# EAGLE design controller2 (EAGLE 7.4.0)
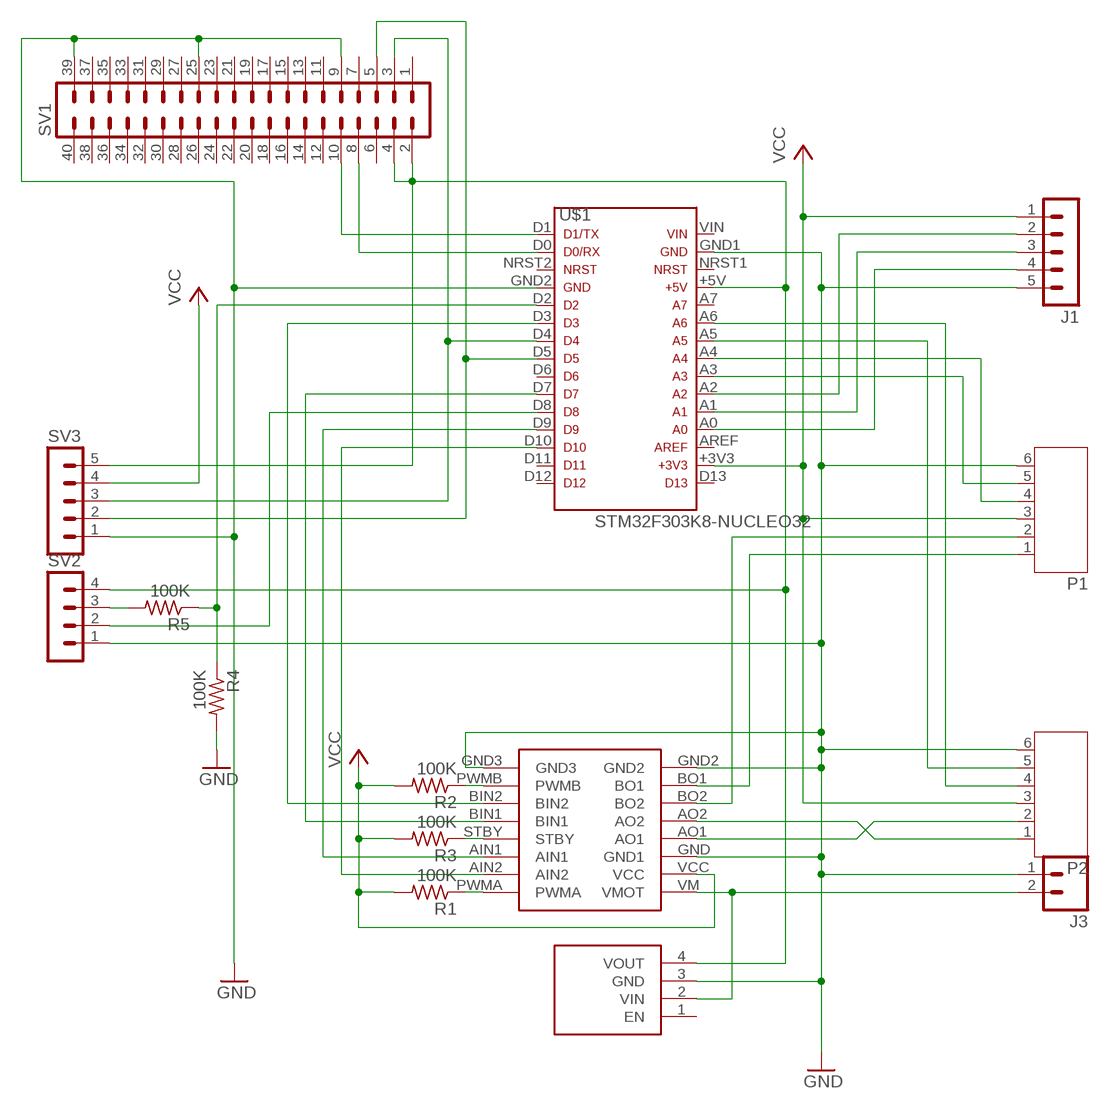
[diagram p0: schematic, sheet 1]

## Parts
J1  MA05-1  [MA05-1]
J3  M02JST-PTH-VERT  [JST-2-PTH-VERT]
P1  JST-PH6  [JST-PH6]
P2  JST-PH6  [JST-PH6]
R1  100K  R-US_M0805  [M0805]
R2  100K  R-US_M0805  [M0805]
R3  100K  R-US_M0805  [M0805]
R4  100K  R-US_M0805  [M0805]
R5  100K  R-US_M0805  [M0805]
SV1  MA20-2  [MA20-2]
SV2  MA04-1  [MA04-1]
SV3  MA05-1  [MA05-1]
U$1  STM32F303K8-NUCLEO32  [NUCLEO32]
U$2  TB6612FNG-CARRIER/SPARKFUN  [TB6612FNG-BRKOUT/SPARKFUN]
U$3  S7V8A  [S7V8]

## Nets
GND: J1.5 J3.1 P1.6 P2.6 R4.2 SV1.9 SV1.25 SV1.39 SV2.1 SV3.1 U$1.GND1 U$1.GND2 U$2.GND2 U$2.GND3 U$2.GND(GND1) U$3.3(GND)
N$1: U$1.D3 U$2.BIN2
N$2: U$1.D7 U$2.BIN1
N$3: U$1.D9 U$2.AIN1
N$4: U$1.D10 U$2.AIN2
N$5: P2.2 U$2.AO1
N$6: R2.1 U$2.PWMB
N$7: R1.1 U$2.PWMA
N$8: R3.1 U$2.STBY
N$9: P2.1 U$2.AO2
N$10: P1.2 U$2.BO2
N$11: P1.1 U$2.BO1
N$12: SV1.3 SV3.3 U$1.D4
N$13: SV1.5 SV3.2 U$1.D5
N$14: SV1.8 U$1.D0
N$15: SV1.10 U$1.D1
N$16: J3.2 U$2.VM(VMOT) U$3.2(VIN)
N$17: P1.4 U$1.A4
N$18: P1.5 U$1.A3
N$19: P2.4 U$1.A6
N$20: P2.5 U$1.A5
N$21: J1.2 U$1.A2
N$22: J1.3 U$1.A1
N$23: J1.4 U$1.A0
N$24: R5.2 SV2.3
N$25: SV1.2 SV1.4 SV2.4 SV3.5 U$1.+5V U$3.4(VOUT)
N$26: R4.1 R5.1 U$1.D2
N$27: SV2.2 U$1.D8
VCC: J1.1 P1.3 P2.3 R1.2 R2.2 R3.2 SV3.4 U$1.+3V3 U$2.VCC
Unconnected: SV1.1 SV1.6 SV1.7 SV1.11 SV1.12 SV1.13 SV1.14 SV1.15 SV1.16 SV1.17 SV1.18 SV1.19 SV1.20 SV1.21 SV1.22 SV1.23 SV1.24 SV1.26 SV1.27 SV1.28 SV1.29 SV1.30 SV1.31 SV1.32 SV1.33 SV1.34 SV1.35 SV1.36 SV1.37 SV1.38 SV1.40 U$1.A7 U$1.AREF U$1.D6 U$1.D11 U$1.D12 U$1.D13 U$1.NRST1 U$1.NRST2 U$1.VIN U$3.1(EN)

## Library data of the parts
J1 SV3 = con-lstb:MA05-1: PIN HEADER; OC_FARNELL: unknown; OC_NEWARK: unknown
J3 = SparkFun-Connectors:M02: Standard 2-pin 0.1" header. Use with - straight break away headers ( PRT-00116) - right angle break away headers (PRT-00553) - swiss pins (PRT-00743) - machine pins (PRT-00117) - female headers (PRT-00115) Molex polarized connector foot print use with: PRT-08233 with associated crimp pins and housings. 2.54_SCREWTERM for use with PRT-10571. 3.5mm Screw Terminal footprints for PRT-08084 5mm Screw Terminal footprints for use with PRT-08432
P1 P2 = jst-ph:JST-PH6
R1-R5 = adafruit:R-US_: RESISTOR, American symbol
SV1 = con-lstb:MA20-2: PIN HEADER; OC_FARNELL: unknown; OC_NEWARK: unknown
SV2 = con-lstb:MA04-1: PIN HEADER; OC_FARNELL: unknown; OC_NEWARK: unknown
U$1 = assorted:STM32F303K8-NUCLEO32
U$2 = assorted:TB6612FNG-CARRIER
U$3 = assorted:S7V8A

## Board
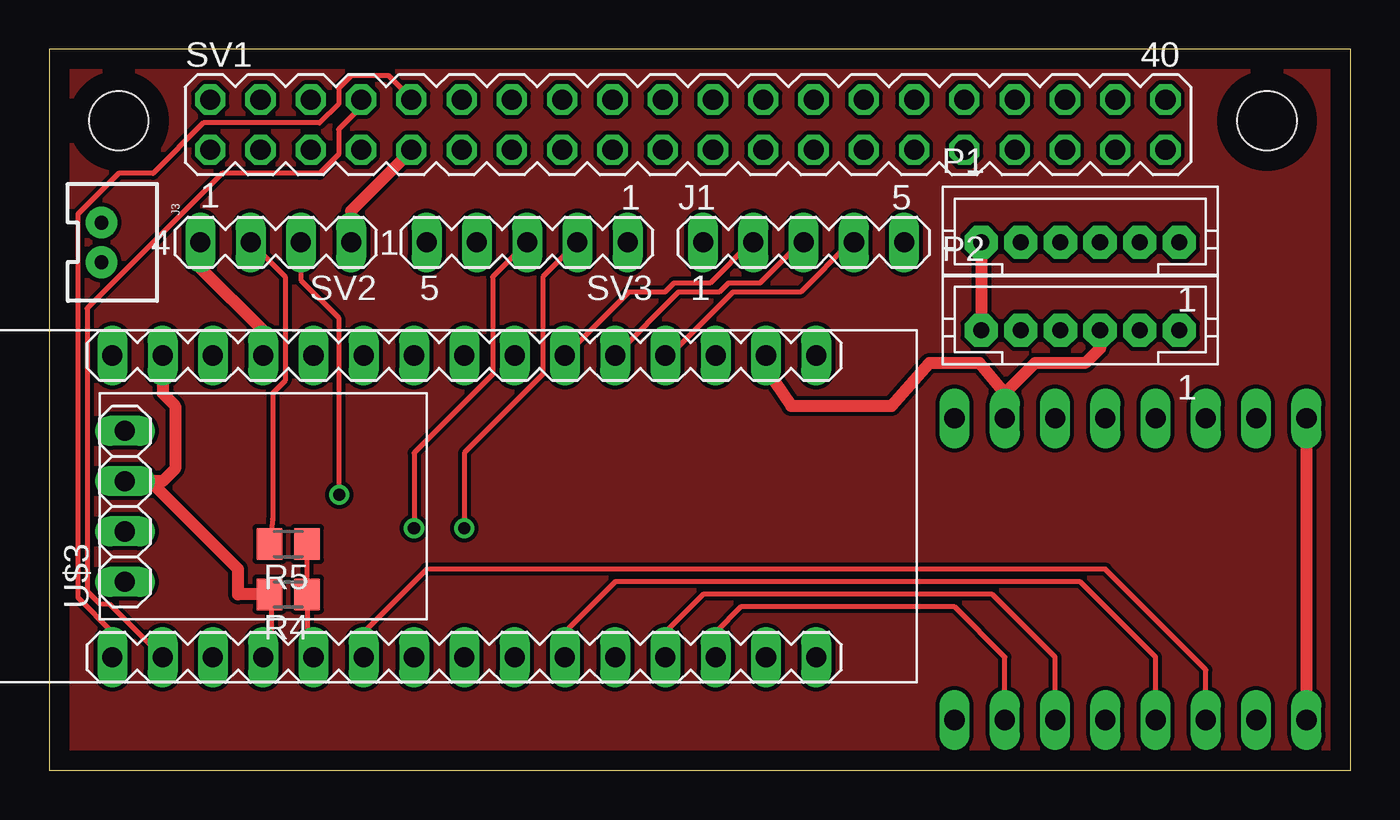
[diagram p1: board, top side]
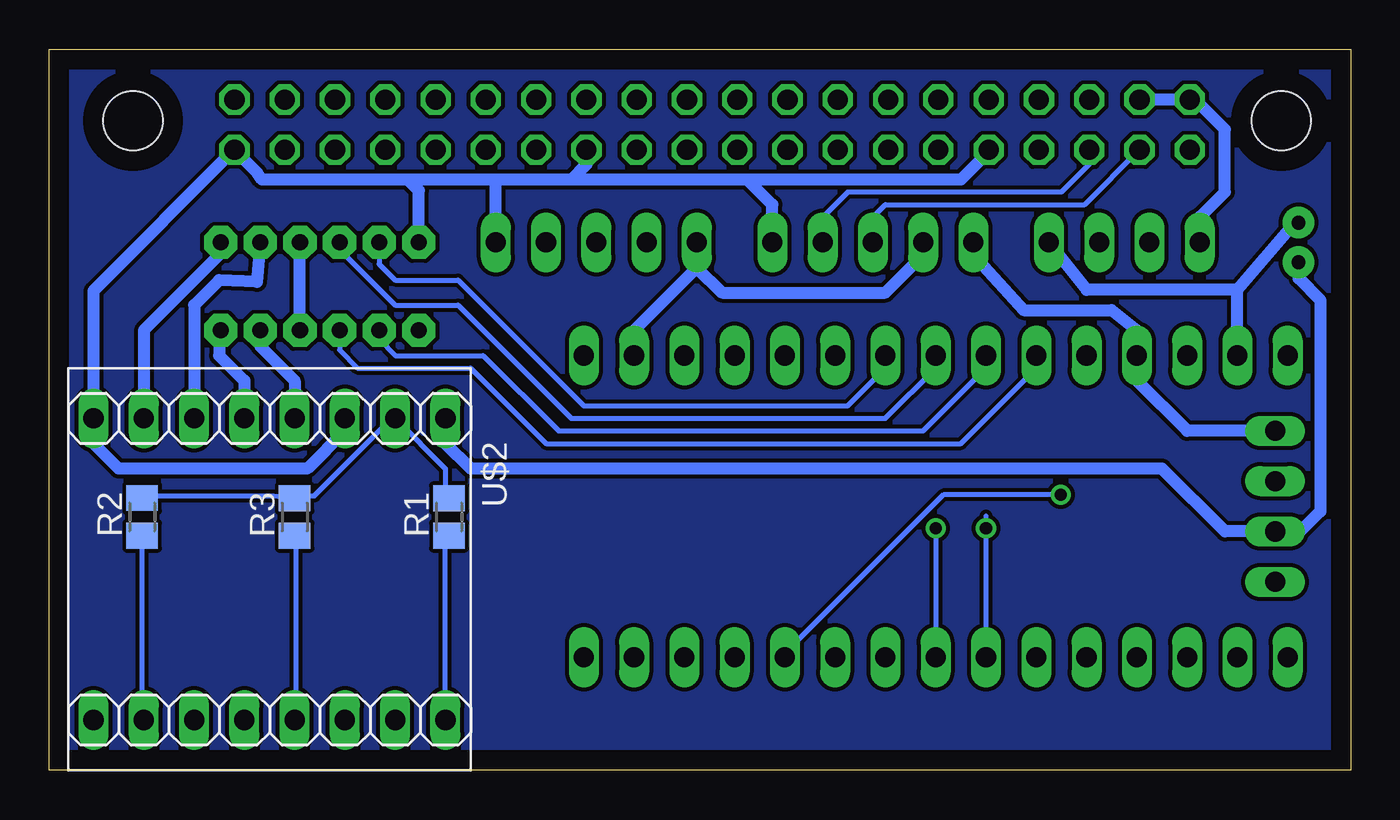
[diagram p2: board, bottom side, seen from below]

Size 65.72 x 36.41 mm. Coordinates in mm from the lower left corner, seen from the top.
Outline: 0,0 65.72,0 65.72,36.41 0,36.41 0,0
Copper layers (1*16): Top 0.035mm / dielectric 1.5mm / Bottom 0.035mm
Design rules "default": minimum track width 10mil, minimum drill 24mil, track to track 8mil, track to pad 8mil, pad to pad 8mil, via to via 8mil, smd to smd 8mil, copper to edge 40mil, drill to drill 8mil, minimum pad ring 10mil, minimum via ring 8mil, stop-mask expansion 4mil, vias tented up to drill 0mil, thermal gap 10mil
Holes 3 mm at 3.5,32.81 61.5,32.81

### Footprints (pad centres in the part's own frame; a part is rotated, then mirrored left to right if it is on the bottom)
MA05-1 = drill 1.016 long: 1 -5.08,0; 2 -2.54,0; 3 0,0; 4 2.54,0; 5 5.08,0
JST-2-PTH-VERT = drill 0.7 pad 1.6: 1 -1,-0.55; 2 1,-0.55
JST-PH6 = drill 0.813 pad 1.676 octagon: 1 5,0; 2 3,0; 3 1,0; 4 -1,0; 5 -3,0; 6 -5,0
M0805 = smd 1.3 x 1.6: 1 -0.95,0; 2 0.95,0
MA20-2 = drill 1.016 octagon: 1 -24.13,-1.27; 2 -24.13,1.27; 3 -21.59,-1.27; 4 -21.59,1.27; 5 -19.05,-1.27; 6 -19.05,1.27; 7 -16.51,-1.27; 8 -16.51,1.27; 9 -13.97,-1.27; 10 -13.97,1.27; 11 -11.43,-1.27; 12 -11.43,1.27; 13 -8.89,-1.27; 14 -8.89,1.27; 15 -6.35,-1.27; 16 -6.35,1.27; 17 -3.81,-1.27; 18 -3.81,1.27; 19 -1.27,-1.27; 20 -1.27,1.27; 21 1.27,-1.27; 22 1.27,1.27; 23 3.81,-1.27; 24 3.81,1.27; 25 6.35,-1.27; 26 6.35,1.27; 27 8.89,-1.27; 28 8.89,1.27; 29 11.43,-1.27; 30 11.43,1.27; 31 13.97,-1.27; 32 13.97,1.27; 33 16.51,-1.27; 34 16.51,1.27; 35 19.05,-1.27; 36 19.05,1.27; 37 21.59,-1.27; 38 21.59,1.27; 39 24.13,-1.27; 40 24.13,1.27
MA04-1 = drill 1.016 long: 1 -3.81,0; 2 -1.27,0; 3 1.27,0; 4 3.81,0
NUCLEO32 = drill 1.016 long: +3V3 7.62,-15.24; +5V 7.62,10.16; A0 7.62,-10.16; A1 7.62,-7.62; A2 7.62,-5.08; A3 7.62,-2.54; A4 7.62,0; A5 7.62,2.54; A6 7.62,5.08; A7 7.62,7.62; AREF 7.62,-12.7; D0 -7.62,15.24; D1 -7.62,17.78; D2 -7.62,7.62; D3 -7.62,5.08; D4 -7.62,2.54; D5 -7.62,0; D6 -7.62,-2.54; D7 -7.62,-5.08; D8 -7.62,-7.62; D9 -7.62,-10.16; D10 -7.62,-12.7; D11 -7.62,-15.24; D12 -7.62,-17.78; D13 7.62,-17.78; GND1 7.62,15.24; GND2 -7.62,10.16; NRST1 7.62,12.7; NRST2 -7.62,12.7; VIN 7.62,17.78
TB6612FNG-BRKOUT/SPARKFUN = drill 1.016 long: AIN1 7.62,3.81; AIN2 7.62,6.35; AO1 -7.62,1.27; AO2 -7.62,-1.27; BIN1 7.62,-1.27; BIN2 7.62,-3.81; BO1 -7.62,-6.35; BO2 -7.62,-3.81; GND -7.62,3.81; GND2 -7.62,-8.89; GND3 7.62,-8.89; PWMA 7.62,8.89; PWMB 7.62,-6.35; STBY 7.62,1.27; VCC -7.62,6.35; VM -7.62,8.89
S7V8 = drill 1.016 long: 1 -3.81,0; 2 -1.27,0; 3 1.27,0; 4 3.81,0

### Placement (x,y rotation side)
J1  38.1,26.67 0 top
J3  3.17,26.67 270 top
P1  52.07,26.67 0 top
P2  52.07,22.23 0 top
R1  45.55,12.79 90 bottom
R2  61.05,12.8 90 bottom
R3  53.34,12.79 90 bottom
R4  12.06,8.89 180 top
R5  12.06,11.43 180 top
SV1  32.25,32.62 0 top
SV2  11.43,26.67 180 top
SV3  24.13,26.67 180 top
U$1  20.95,13.34 90 top
U$2  54.61,10.16 270 bottom
U$3  3.81,13.34 90 top

### Tracks (layer width: path | path; a pad name or v marks a point on that pad's centre or on a via)
GND
  Top 0.254: 18.26,31.27 SV1.9 | U$1.GND2 10.97,5.71 10.97,6.63 11.2,6.86 11.2,8.69 R4.2
  Top 0.61: U$2.GND2 U$2.GND3 | SV2.1 15.24,28.26 18.26,31.27 | P1.6 P2.6 | R4.2 9.53,8.89 9.53,10.16 5.08,14.61 U$3.3 5.71,14.61 6.35,15.24 6.35,18.41 5.71,19.05 U$1.GND1
  Bottom 0.61: SV1.25 38.6,30.61 39.37,29.84 | 39.37,29.84 43.18,29.84 | 43.18,29.84 47.62,29.84 | 47.62,29.84 54.99,29.84 55.24,30.21 SV1.39 63.5,24.23 U$2.GND2 63.5,16.51 62.23,15.24 52.7,15.24 50.8,17.14 U$2.GND | P1.6 47.07,29.29 47.62,29.84 | J1.5 43.18,29.84 | SV3.1 29.21,28.57 30.48,29.84 | 30.48,29.84 39.37,29.84 | SV1.9 18.28,31.25 19.68,29.84 30.48,29.84 | J3.1 2.81,27.67 5.71,24.27 | U$1.GND1 5.71,24.27 | 5.71,24.27 13.34,24.27 SV2.1
N$1
  Top 0.254: U$2.BIN2 58.42,5.08 53.34,10.16 19.05,10.16 15.88,6.99 U$1.D3
N$2
  Top 0.254: U$2.BIN1 55.88,5.71 52.07,9.53 28.57,9.53 26.04,6.99 U$1.D7
N$3
  Top 0.254: U$2.AIN1 50.8,5.71 47.62,8.89 33.02,8.89 31.11,6.99 U$1.D9
N$4
  Top 0.254: U$2.AIN2 48.26,5.71 45.72,8.26 34.92,8.26 33.66,6.99 U$1.D10
N$5
  Bottom 0.61: P2.2 55.07,21.41 53.34,19.68 U$2.AO1
N$6
  Bottom 0.254: R2.1 61.04,11.81 61.04,2.67 U$2.PWMB
N$7
  Bottom 0.254: U$2.PWMA 45.72,11.81 R1.1
N$8
  Bottom 0.254: R3.1 53.26,11.81 53.26,2.67 U$2.STBY
N$9
  Bottom 0.61: P2.1 57.07,21.67 57.15,21.59 57.15,20.95 55.88,19.68 U$2.AO2
N$10
  Bottom 0.61: P1.2 55.24,24.67 57.15,24.77 58.42,23.5 U$2.BO2
N$11
  Bottom 0.61: P1.1 57.07,26.11 60.96,22.23 U$2.BO1
N$12  (via drill 0.61)
  Top 0.254: v18.41,12.22 18.41,16.03 22.38,20 22.38,24.92 SV3.3
  Bottom 0.254: SV3.3 24.13,27.94 23.5,28.57 13.43,28.57 SV1.3 | 18.41,12.86 v18.41,12.22 | v18.41,12.22 18.41,12.04 | 18.41,12.04 U$1.D4 | 18.41,12.04 18.52,12.04 v18.41,12.22
N$13  (via drill 0.61)
  Top 0.254: v20.95,12.22 20.95,16.03 24.92,20 24.92,24.92 SV3.2
  Bottom 0.254: v20.95,12.22 U$1.D5 | SV1.5 13.2,30.61 14.61,29.21 25.4,29.21 26.67,27.94 SV3.2
N$14
  Top 0.254: U$1.D0 3.02,8.41 2.54,8.41 1.91,9.05 1.91,23.34 8.73,30.16 13.65,30.16 14.61,31.11 14.61,32.38 15.88,33.66 SV1.8
N$15
  Top 0.254: U$1.D1 3.17,6.99 1.43,8.73 1.43,28.1 3.49,30.16 5.24,30.16 7.78,32.7 13.65,32.7 14.61,33.66 14.61,34.45 15.24,35.08 17.14,35.08 18.26,33.97 SV1.10
N$16
  Bottom 0.61: U$2.VM 45.72,16.51 44.45,15.24 9.53,15.24 6.35,12.06 U$3.2 2.54,12.06 1.52,13.09 1.52,23.75 2.62,24.85 J3.2
N$17
  Bottom 0.254: P1.4 51.07,26.3 48.26,23.5 45.09,23.5 39.37,17.78 23.5,17.78 20.95,20.32 U$1.A4
N$18
  Bottom 0.254: P1.5 49.07,25.57 48.26,24.77 45.09,24.77 38.73,18.41 25.4,18.41 23.5,20.32 U$1.A3
N$19
  Bottom 0.254: P2.4 51.07,21.23 50.16,20.32 44.45,20.32 40.64,16.51 19.68,16.51 15.88,20.32 U$1.A6
N$20
  Bottom 0.254: P2.5 49.07,21.77 48.26,20.95 43.81,20.95 40.01,17.14 21.59,17.14 18.41,20.32 U$1.A5
N$21
  Top 0.254: U$1.A2 26.06,20.95 29.26,24.16 31.09,24.16 31.55,24.61 33.38,24.61 35.43,26.67 J1.2
N$22
  Top 0.254: U$1.A1 31.77,24.16 33.83,24.16 34.29,24.61 35.89,24.61 37.95,26.67 J1.3
N$23
  Top 0.254: U$1.A0 31.32,20.95 34.52,24.16 37.95,24.16 40.46,26.67 J1.4
N$24
  Top 0.254: SV2.3 11.91,24.92 11.91,19.68 11.27,19.05 11.27,12.7 R5.2
N$25
  Top 0.61: SV2.4 7.62,25.4 10.79,22.23 U$1.+5V
  Bottom 0.61: SV2.4 7.62,27.94 6.35,29.21 6.35,32.38 7.62,33.66 7.89,33.66 SV1.2 SV1.4 | SV3.5 19.05,26.04 16.51,23.25 12.06,23.25 10.79,22.23 U$1.+5V 10.79,19.68 8.26,17.14 U$3.4
N$26
  Top 0.254: R5.1 R4.1 13.02,6.04 U$1.D2
N$27  (via drill 0.61)
  Top 0.254: SV2.2 12.7,24.77 14.61,22.86 14.61,13.97 v14.63,13.92
  Bottom 0.254: v14.63,13.92 20.57,13.92 28.57,5.92 U$1.D8
N$29
  pour Top: 0,36.2 66.04,36.2 66.04,0 0,0
N$30
  pour Bottom: 0,36.2 66.04,36.2 66.04,0 0,0
VCC
  Top 0.61: P2.3 53.07,21.32 52.32,20.57 49.78,20.57 48.26,19.05 | U$1.+3V3 36.2,20.32 37.47,18.41 42.55,18.41 44.45,20.57 46.99,20.57 48.26,19.05 | U$2.VCC 48.26,19.05
  Bottom 0.254: R1.2 45.72,13.87 45.72,15.24 U$2.VCC 48.46,17.75 52.35,13.87 53.26,13.87 R3.2 54.41,13.87 61.04,13.87 R2.2
  Bottom 0.61: P2.3 P1.3 | U$1.+3V3 36.2,22.23 33.02,25.4 | J1.1 33.02,25.4 | 33.02,25.4 31.75,24.13 23.5,24.13 21.59,26.04 SV3.4